# Altium project RPi-CM-Lite.PrjPcb (part 5 of 5)

## Sheet HDMI2CVBS.SchDoc
size A4; SheetNumber: 7; SheetTotal: 7
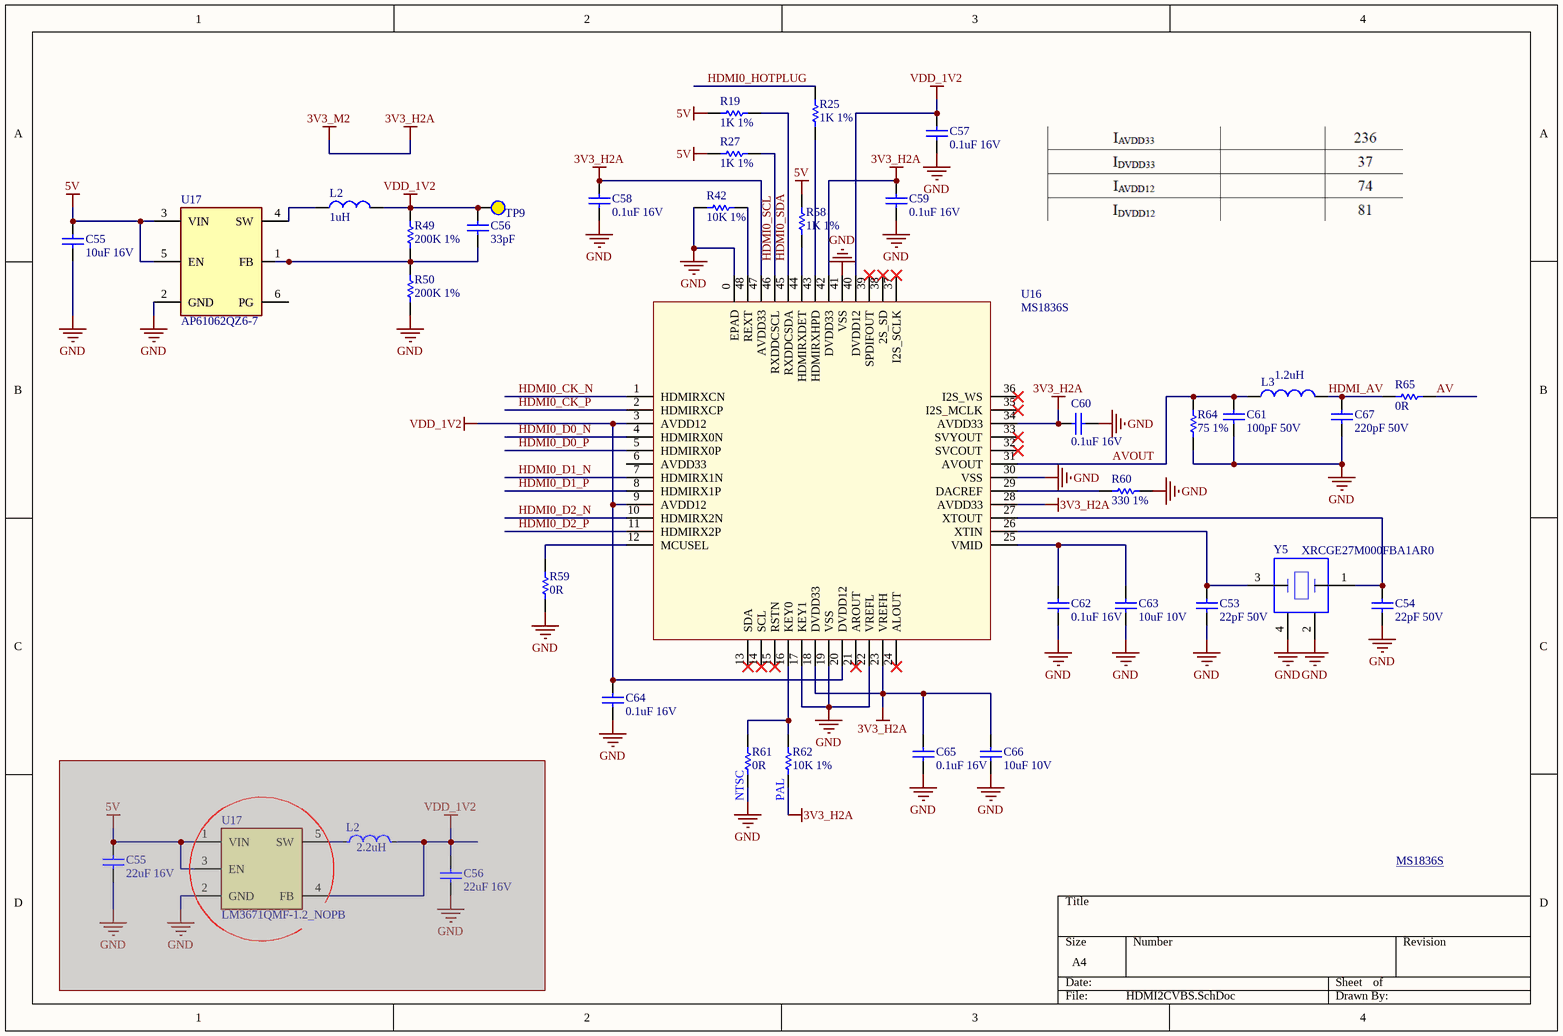
[diagram p6: HDMI2CVBS.SchDoc]

### Parts
(Parts that share a designator on the sheet are numbered #1, #2 ... from top to bottom, then left to right.)
C53  22pF 50V  [0402]
C54  22pF 50V  [0402]
C55#1  10uF 16V  [C0805]
C55#2  22uF 16V  [C0805]  (masked out: inside a compile mask, not in the netlist)
C56#1  33pF  [0402]
C56#2  22uF 16V  [C0805]  (masked out: inside a compile mask, not in the netlist)
C57  0.1uF 16V  [0402]
C58  0.1uF 16V  [0402]
C59  0.1uF 16V  [0402]
C60  0.1uF 16V  [0402]
C61  100pF 50V  [0402]
C62  0.1uF 16V  [0402]
C63  10uF 10V  [1608[0603]]
C64  0.1uF 16V  [0402]
C65  0.1uF 16V  [0402]
C66  10uF 10V  [1608[0603]]
C67  220pF 50V  [0402]
L2#1  1uH  [INDC2012X145N]
L2#2  Inductance: 2.2uH  [FP-MLZ2012-1_25-IPC_A]  (hidden comment: MLZ2012M2R2HT000)  (masked out: inside a compile mask, not in the netlist)
L3  1.2uH  [0402_CAP]
R19  1K 1%  [0402]
R25  1K 1%  [0402]
R27  1K 1%  [0402]
R42  10K 1%  [0402]
R49#2  200K 1%  [0402]
R50  200K 1%  [0402]
R58  1K 1%  [0402]
R59  0R  [0402]
R60  330 1%  [0402]
R61  0R  [0402]
R62  10K 1%  [0402]
R64  75 1%  [0402]
R65  0R  [0402]
TP9  TESTPOINT  [TESTPOINT_0.9]  (value not drawn)  (no BOM)
U16  MS1836S  [PQFN50P700X700X100_HS-49M]
U17#1  AP61062QZ6-7  [AP61062Q]
U17#2  LM3671QMF-1.2_NOPB  [SOT95P280X145-5N]  (masked out: inside a compile mask, not in the netlist)
Y5  XRCGE27M000FBA1AR0  [XRCGE20M000F3A1AR0]

### Nets
3V3_H2A: C58.2 C59.2 C60.2 C65.1 C66.2 R62.2 U16.18(DVDD33) U16.23(VREFH) U16.28(AVDD33) U16.34(AVDD33) U16.42(DVDD33) U16.47(AVDD33)  [also labelled 3V3_M2]
5V: C55#1.2 R19.2 R27.2 R58.2 U17#1.3(VIN) U17#1.5(EN)
GND: C53.1 C54.1 C55#1.1 C57.1 C58.1 C59.1 C60.1 C61.1 C62.2 C63.1 C64.2 C65.2 C66.1 C67.1 R42.2 R50.1 R59.2 R60.2 R61.2 R64.1 U16.0(EPAD) U16.17(KEY1) U16.19(VSS) U16.22(VREFL) U16.30(VSS) U16.41(VSS) U17#1.2(GND) Y5.2 Y5.4
VDD_1V2: C56#1.2 C57.2 C64.1 L2#1.2 R49#2.2 TP9.1 U16.3(AVDD12) U16.9(AVDD12) U16.20(DVDD12) U16.40(DVDD12)
AV: R65.2
AVOUT: C61.2 L3.1 R64.2 U16.31(AVOUT)
HDMI0_CK_N: U16.1(HDMIRXCN)
HDMI0_CK_P: U16.2(HDMIRXCP)
HDMI0_D0_N: U16.4(HDMIRX0N)
HDMI0_D0_P: U16.5(HDMIRX0P)
HDMI0_D1_N: U16.7(HDMIRX1N)
HDMI0_D1_P: U16.8(HDMIRX1P)
HDMI0_D2_N: U16.10(HDMIRX2N)
HDMI0_D2_P: U16.11(HDMIRX2P)
HDMI0_HOTPLUG: R25.2
HDMI0_SCL: R27.1 U16.46(RXDDCSCL)
HDMI0_SDA: R19.1 U16.45(RXDDCSDA)
HDMI_AV: C67.2 L3.2 R65.1
NetC53_2: C53.2 U16.26(XTIN) Y5.3
NetC54_2: C54.2 U16.27(XTOUT) Y5.1
NetC56#1_1: C56#1.1 R49#2.1 R50.2 U17#1.1(FB)
NetC62_1: C62.1 C63.2 U16.25(VMID)
NetL2#1_1: L2#1.1 U17#1.4(SW)
NetR25_1: R25.1 U16.43(HDMIRXHPD)
NetR42_1: R42.1 U16.48(REXT)
NetR58_1: R58.1 U16.44(HDMIRXDET)
NetR59_1: R59.1 U16.12(MCUSEL)
NetR60_1: R60.1 U16.29(DACREF)
NetR61_1: R61.1 R62.1 U16.16(KEY0)

Not connected (* = marked no-connect by the designer): U16 6(AVDD33) 13(SDA)* 14(SCL)* 15(RSTN)* 21(AROUT)* 24(ALOUT)* 32(SVCOUT)* 33(SVYOUT)* 35(I2S_MCLK)* 36(I2S_WS)* 37(I2S_SCLK)* 38(2S_SD)* 39(SPDIFOUT)*; U17#1 6(PG)

### Notes on the sheet
- (near R61) NTSC
- (near R62) PAL
- MS1836S <http://en.macrosilicon.com/info.asp?base_id=2&third_id=47>

### Library data of the parts
C53 C54 = Cap22PF_50V: Ceramic Capacitor (Surface Mount); Manufacturer: TDK Corporation; Manufacturer Part Number: C1005C0G1H220J050BA; Tolerance: ±5%; Temperature Coefficient: C0G, NP0; Supplier 1: Digi-Key; RoHS: RoHS Compliant; Category: Capacitors; Stock 1: 109785; Pricing 1: 1=0.1, 10=0.024, 100=0.011, 250=0.009, 500=0.0077, 1000=0.006, 5000=0.005 (USD); Packaging: Cut Tape (CT); Capacitance: 22pF; Voltage - Rated: 50V; Mounting Type: Surface Mount, MLCC; Operating Temperature: -55°C ~ 125°C; Applications: General Purpose; Ratings: -; Package / Case: 0402 (1005 Metric); Size / Dimension: 0.039" L x 0.020" W (1.00mm x 0.50mm); Height - Seated (Max): -; Thickness (Max): 0.022" (0.55mm); Lead Spacing: -; Features: -; Lead Style: -; ComponentLink1URL: https://product.tdk.com/info/en/catalog/datasheets/mlcc_commercial_general_en.pdf; ComponentLink1Description: https://product.tdk.com/info/en/catalog/datasheets/mlcc_commercial_general_en.pdf; Supplier Part Number 1: 445-1239-1-ND
C55#1 = Cap10UF_16V_0805_X7R: 16V 10uF X7R ±10% 0805 Multilayer Ceramic Capacitors MLCC - SMD/SMT ROHS; Manufacturer: Samsung Electro-Mechanics; Manufacturer Part Number: CL21B106KOQNNNE; Value: 10µF; Supplier 1: Mouser; Supplier Part Number 1: 187-CL21B106KOQNNNE; Supplier: Mouser; Supplier Part Number: 187-CL21B106KOQNNNE; RoHS: Compliant; Category: Ceramic Capacitors; Stock: 602217; Pricing: 1=0.22, 1=0.189, 10=0.133, 10=0.114, 50=0.133, 100=0.069, 100=0.08, 500=0.055, 1000=0.054, 1000=0.046, 2000=0.046, 4000=0.04, 10000=0.044, 10000=0.038, 24000=0.037 (USD); ComponentLink1URL: https://datasheet.octopart.com:443/CL21B106KOQNNNE-Samsung-Electro-Mechanics-datasheet-136482503.pdf?src-supplier=IHS; ComponentLink1Description: https://datasheet.octopart.com:443/CL21B106KOQNNNE-Samsung-Electro-Mechanics-datasheet-136482503.pdf?src-supplier=IHS; Case/Package: 0805; Case Code (Imperial): 0805; Case Code (Metric): 2012; China RoHS: Compliant; Contact Plating: Tin; Depth: 1.25mm; Dielectric: X7R; Dielectric Material: Ceramic; Height: 1.4mm; Length: 2mm; Lifecycle Status: Production; Material: Ceramic; Max Operating Temperature: 125°C; Min Operating Temperature: -55°C; Mounting Technology: Surface Mount; Number of Terminals: 2; Radiation Hardening: No; REACH SVHC: Yes; Schedule B: 8532240020, 8532240020|8532240020, 8532240020|8532240020|8532240020, 8532240020|8532240020|8532240020|8532240020; Thickness: 1.397mm; Tolerance: 10%; Voltage: 16V; Voltage Rating: 16V; Voltage Rating (DC): 16V; Width: 1.25mm; ComponentLink2URL: https://datasheet.octopart.com:443/CL21B106KOQNNNE-Samsung-Electro-Mechanics-datasheet-116891046.pdf?src-supplier=Future+Electronics; ComponentLink2Description: https://datasheet.octopart.com:443/CL21B106KOQNNNE-Samsung-Electro-Mechanics-datasheet-116891046.pdf?src-supplier=Future+Electronics; ComponentLink3URL: https://datasheet.octopart.com:443/CL21B106KOQNNNE-Samsung-Electro-Mechanics-datasheet-81462191.pdf?src-supplier=Future+Electronics; ComponentLink3Description: https://datasheet.octopart.com:443/CL21B106KOQNNNE-Samsung-Electro-Mechanics-datasheet-81462191.pdf?src-supplier=Future+Electronics; ComponentLink4URL: https://datasheet.octopart.com:443/CL21B106KOQNNNE-Samsung-datasheet-12530662.pdf?src-supplier=Future+Electronics; ComponentLink4Description: https://datasheet.octopart.com:443/CL21B106KOQNNNE-Samsung-datasheet-12530662.pdf?src-supplier=Future+Electronics; ComponentLink5URL: https://datasheet.octopart.com:443/CL21B106KOQNNNE-Samsung-datasheet-26669285.pdf?src-supplier=Future+Electronics; ComponentLink5Description: https://datasheet.octopart.com:443/CL21B106KOQNNNE-Samsung-datasheet-26669285.pdf?src-supplier=Future+Electronics; ComponentLink6URL: https://datasheet.octopart.com:443/CL21B106KOQNNNE-Samsung-Electro-Mechanics-datasheet-149045986.pdf?src-supplier=Future+Electronics; ComponentLink6Description: https://datasheet.octopart.com:443/CL21B106KOQNNNE-Samsung-Electro-Mechanics-datasheet-149045986.pdf?src-supplier=Future+Electronics; ComponentLink7URL: https://datasheet.octopart.com/CL21B106KOQNNNE-Samsung-Electro-Mechanics-datasheet-97040617.pdf; ComponentLink7Description: https://datasheet.octopart.com/CL21B106KOQNNNE-Samsung-Electro-Mechanics-datasheet-97040617.pdf; ComponentLink8URL: https://datasheet.octopart.com/CL21B106KOQNNNE-Samsung-Electro-Mechanics-datasheet-8324245.pdf; ComponentLink8Description: https://datasheet.octopart.com/CL21B106KOQNNNE-Samsung-Electro-Mechanics-datasheet-8324245.pdf; ComponentLink9URL: https://datasheet.octopart.com/General-Multilayer-Ceramic-Capacitors-Samsung-datasheet-family-111.pdf; ComponentLink9Description: https://datasheet.octopart.com/General-Multilayer-Ceramic-Capacitors-Samsung-datasheet-family-111.pdf; ComponentLink10URL: https://datasheet.octopart.com:443/CL21B106KOQNNNE-Samsung-Electro-Mechanics-datasheet-11806859.pdf?src-supplier=Arrow+Electronics; ComponentLink10Description: https://datasheet.octopart.com:443/CL21B106KOQNNNE-Samsung-Electro-Mechanics-datasheet-11806859.pdf?src-supplier=Arrow+Electronics; ComponentLink11URL: https://datasheet.octopart.com:443/CL21B106KOQNNNE-Samsung-datasheet-8326407.pdf?src-supplier=TME; ComponentLink11Description: https://datasheet.octopart.com:443/CL21B106KOQNNNE-Samsung-datasheet-8326407.pdf?src-supplier=TME; ComponentLink12URL: http://sigma.octopart.com:80/rohs_certificate/General-Multilayer-Ceramic-Capacitors-Samsung-family-110.pdf?src-supplier=Compliance+Statements; ComponentLink12Description: http://sigma.octopart.com:80/rohs_certificate/General-Multilayer-Ceramic-Capacitors-Samsung-family-110.pdf?src-supplier=Compliance+Statements; ComponentLink13URL: http://sigma.octopart.com:80/rohs_statement/General-Multilayer-Ceramic-Capacitors-Samsung-family-132.pdf?src-supplier=Compliance+Statements; ComponentLink13Description: http://sigma.octopart.com:80/rohs_statement/General-Multilayer-Ceramic-Capacitors-Samsung-family-132.pdf?src-supplier=Compliance+Statements; ComponentLink14URL: http://sigma.octopart.com:80/reach_statement/General-Multilayer-Ceramic-Capacitors-Samsung-family-133.pdf?src-supplier=Compliance+Statements; ComponentLink14Description: http://sigma.octopart.com:80/reach_statement/General-Multilayer-Ceramic-Capacitors-Samsung-family-133.pdf?src-supplier=Compliance+Statements
C55#2 C56#2 = Cap22UF_16V: Ceramic Capacitor (Surface Mount); Manufacturer: Samsung Electro-Mechanics America, Inc.; Manufacturer Part Number: CL21A226MOCLRNC; Capacitance: 22µF; Tolerance: ±20%; Temperature Coefficient: X5R; Supplier 1: Digi-Key; RoHS: RoHS Compliant; Category: Capacitors; Stock 1: 185791; Pricing 1: 1=0.24, 10=0.168, 25=0.1344, 50=0.1118, 100=0.0951, 250=0.07548, 500=0.0671, 1000=0.05872 (USD); Packaging: Cut Tape (CT); Part Status: Active; Voltage - Rated: 16V; Operating Temperature: -55°C ~ 85°C; Features: Low Profile; Ratings: -; Applications: General Purpose; Mounting Type: Surface Mount, MLCC; Package / Case: 0805 (2012 Metric); Size / Dimension: 0.079" L x 0.049" W (2.00mm x 1.25mm); Height - Seated (Max): -; Thickness (Max): 0.037" (0.95mm); Lead Spacing: -; Lead Style: -; ComponentLink1URL: http://www.samsungsem.com/kr/support/library/product-catalog/__icsFiles/afieldfile/2016/09/27/MLCC.pdf; ComponentLink1Description: http://www.samsungsem.com/kr/support/library/product-catalog/__icsFiles/afieldfile/2016/09/27/MLCC.pdf; Supplier Part Number 1: 1276-6780-1-ND; Supplier 2: Mouser; Supplier Part Number 2: 81-GRM219R61C226ME1K
C56#1 = Cap33PF: Ceramic Capacitor (Surface Mount); Tolerance: ±1%; Supplier 1: Mouser; Supplier Part Number 1: 81-GJM1555C1H330FB1D
C57-C60 C62 C64 C65 = Cap0.1UF_16V_X7R: 0402 0.1 uF 16V ±10% Tolerance X7R SMT Multilayer Ceramic Capacitor; Manufacturer: Murata; Manufacturer Part Number: GCM155R71C104KA55J; Value: 100nF; RoHS: Yes; Category: Ceramic Capacitors; Stock 1: 2121057; Pricing 1: 1=0,10000, 10=0,01800, 50=0,01800, 100=0,01500, 1000=0,00900, 10000=0,00700 (USD); Mounting Technology: Surface Mount; Case/Package: 0402; Case Code (Imperial): 0402; Case Code (Metric): 1005; Min Operating Temperature: -55°C; Max Operating Temperature: 125°C; Tolerance: 10%; Voltage Rating: 16V; Voltage Rating (DC): 16V; Packaging: Tape and Reel; Package Quantity: 1; Dielectric: X7R; Termination: SMD/SMT; Series: GCM; Construction: Flat; Length: 1mm; Width: 0.5mm; Height: 0.5mm; Thickness: 0.022inch; Depth: 0.5mm; Ratings: AEC-Q200; Radiation Hardening: No; Lead Free: Lead Free; RoHS Compliant: Yes; ComponentLink1URL: https://datasheet.ciiva.com/11618/product-11618848.pdf?src-supplier=Avnet; ComponentLink1Description: https://datasheet.ciiva.com/11618/product-11618848.pdf?src-supplier=Avnet; ComponentLink2URL: https://datasheet.ciiva.com/16440/gcm155r71c104ka55j-16440393.pdf?src-supplier=Future+Electronics; ComponentLink2Description: https://datasheet.ciiva.com/16440/gcm155r71c104ka55j-16440393.pdf?src-supplier=Future+Electronics; ComponentLink3URL: https://datasheet.ciiva.com/29542/product-29542474.pdf?src-supplier=Digi-Key; ComponentLink3Description: https://datasheet.ciiva.com/29542/product-29542474.pdf?src-supplier=Digi-Key; ComponentLink4URL: https://datasheet.ciiva.com/29542/product-29542475.pdf?src-supplier=Digi-Key; ComponentLink4Description: https://datasheet.ciiva.com/29542/product-29542475.pdf?src-supplier=Digi-Key; Supplier 1: Mouser; Supplier 2: Digi-Key; Supplier Part Number 1: 81-GCM155R71C104KA5J; Supplier Part Number 2: 490-7998-1-ND
C61 = Cap100PF_50V: Ceramic Capacitor (Surface Mount); Manufacturer: Yageo; Manufacturer Part Number: CC0402JRNPO9BN101; Tolerance: ±5%; Temperature Coefficient: C0G, NP0; Supplier 1: Digi-Key; RoHS: RoHS Compliant; Category: Capacitors; Stock 1: 1690327; Pricing 1: 1=0.1, 10=0.013, 25=0.0092, 100=0.006, 250=0.00492, 500=0.0042, 1000=0.00328, 2500=0.00295, 5000=0.00273 (USD); Packaging: Cut Tape (CT); Part Status: Active; Capacitance: 100pF; Voltage - Rated: 50V; Operating Temperature: -55°C ~ 125°C; Features: -; Ratings: -; Applications: General Purpose; Failure Rate: -; Mounting Type: Surface Mount, MLCC; Package / Case: 0402 (1005 Metric); Size / Dimension: 0.039" L x 0.020" W (1.00mm x 0.50mm); Height - Seated (Max): -; Thickness (Max): 0.022" (0.55mm); Lead Spacing: -; Lead Style: -; ComponentLink1URL: http://www.yageo.com/NewPortal/yageodocoutput?fileName=/pdf/MLCC/UPY-GP_NP0_16V-to-50V_14.pdf; ComponentLink1Description: http://www.yageo.com/NewPortal/yageodocoutput?fileName=/pdf/MLCC/UPY-GP_NP0_16V-to-50V_14.pdf; Supplier Part Number 1: 311-1024-1-ND
C63 C66 = Cap10UF_10V_0603: Ceramic Capacitor (Surface Mount) Low ESL; Manufacturer: TDK; Manufacturer Part Number: C1608X5R1A106M080AC; Tolerance: 20%; Dielectric: X5R; Supplier 1: Digi-Key; Stock 1: 549066; Pricing 1: 1=0.43, 10=0.298, 100=0.1785, 500=0.1339, 1000=0.1131 (USD); Mount: Surface Mount; Case/Package: 0603; Number of Pins: 2; Weight: 7.1E-05oz; Case Code (Metric): 1608; Case Code (Imperial): 0603; Dielectric Material: Ceramic; Min Operating Temperature: -55°C; Max Operating Temperature: 85°C; Capacitance: 10uF; Voltage Rating: 10V; Packaging: Tape and Reel; Package Quantity: 1; Voltage Rating (DC): 10V; Termination: SMD/SMT; Composition: Ceramic; Length: 1.6mm; Height: 0.8mm; Width: 0.031inch; Thickness: 0.035inch; Depth: 0.8mm; Radiation Hardening: No; REACH SVHC: No SVHC; Lead Free: Lead Free; ComponentLink1URL: https://datasheet.ciiva.com/15192/getdatasheetpartid-722046-15192006.pdf; ComponentLink1Description: https://datasheet.ciiva.com/15192/getdatasheetpartid-722046-15192006.pdf; ComponentLink2URL: https://datasheet.ciiva.com/17487/e412-c-17487513.pdf; ComponentLink2Description: https://datasheet.ciiva.com/17487/e412-c-17487513.pdf; ComponentLink3URL: https://datasheet.ciiva.com/24312/2958c1608x5r1a106m080ac-24312391.pdf; ComponentLink3Description: https://datasheet.ciiva.com/24312/2958c1608x5r1a106m080ac-24312391.pdf; ComponentLink4URL: https://datasheet.ciiva.com/16508/e412-c-16508686.pdf; ComponentLink4Description: https://datasheet.ciiva.com/16508/e412-c-16508686.pdf; ComponentLink5URL: https://datasheet.ciiva.com/22749/1744655-22749594.pdf; ComponentLink5Description: https://datasheet.ciiva.com/22749/1744655-22749594.pdf; ComponentLink6URL: https://datasheet.ciiva.com/36857/1796654-36857302.pdf; ComponentLink6Description: https://datasheet.ciiva.com/36857/1796654-36857302.pdf; ComponentLink7URL: https://datasheet.ciiva.com/6288/tdkmlcccaprange-6288534.pdf; ComponentLink7Description: https://datasheet.ciiva.com/6288/tdkmlcccaprange-6288534.pdf; ComponentLink8URL: https://datasheet.ciiva.com/22676/639999-22676919.pdf; ComponentLink8Description: https://datasheet.ciiva.com/22676/639999-22676919.pdf; ComponentLink9URL: https://datasheet.ciiva.com/48671/e412-c-48671302.pdf; ComponentLink9Description: https://datasheet.ciiva.com/48671/e412-c-48671302.pdf; Supplier Part Number 1: 445-6853-1-ND
C67 = Cap220PF_50V: Multilayer Ceramic Capacitor, 220 pF, 50 V, ± 5%, C0G (NP0), 0402 [1005 Metric]; Manufacturer: Samsung; Manufacturer Part Number: CL05C221JB51PNC; Material: 4241ConductorMaterial; Temperature Coefficient: 30ppm/°C; Supplier: Mouser; Supplier Part Number: 187-CL05C221JB51PNC; RoHS: Yes; Category: Ceramic Capacitors; Stock: 196350; Pricing: 1=0.1, 10=0.021, 50=0.021, 100=0.015, 1000=0.012, 10000=0.008 (USD); Height: 550um; ComponentLink1URL: http://www.samsungsem.com/kr/support/product-search/mlcc/CL05C221JB51PNC.jsp?src-supplier=Digikey; ComponentLink1Description: http://www.samsungsem.com/kr/support/product-search/mlcc/CL05C221JB51PNC.jsp?src-supplier=Digikey; ComponentLink2URL: http://www.samsungsem.com/kr/support/library/product-catalog/mlcc.jsp?src-supplier=Digikey; ComponentLink2Description: http://www.samsungsem.com/kr/support/library/product-catalog/mlcc.jsp?src-supplier=Digikey; ComponentLink3URL: https://datasheet.octopart.com/CL05C221JB51PNC-Samsung-Electro-Mechanics-datasheet-149154090.pdf?src-supplier=Future+Electronics; ComponentLink3Description: https://datasheet.octopart.com/CL05C221JB51PNC-Samsung-Electro-Mechanics-datasheet-149154090.pdf?src-supplier=Future+Electronics; ComponentLink4URL: https://datasheet.octopart.com/CL05C221JB51PNC-Samsung-datasheet-8326407.pdf?src-supplier=TME; ComponentLink4Description: https://datasheet.octopart.com/CL05C221JB51PNC-Samsung-datasheet-8326407.pdf?src-supplier=TME; Supplier 1: Mouser; Supplier Part Number 1: 187-CL05C221JB51PNC
L2#1 = INDUCTOR_1uH_800mA_MLZ2012M1R0HT000: Inductor Power Shielded Multi-Layer 1uH 20% 2MHz Ferrite 0.8A 0.13Ohm DCR 0805 T/R; Manufacturer_Name: TDK; Manufacturer Lifecycle Status: PRODUCTION; Current Rating: 800mA; DC Resistance (DCR): 130mΩ; Value: 1µH; Number of Circuits: 1; Saturation Current: 700mA; Self Resonant Frequency: 150MHz; Shielding: Yes; Datasheet Link: https://product.tdk.com/system/files/dam/doc/product/inductor/inductor/smd/catalog/inductor_commercial_decoupling_mlz2012_en.pdf; Height: 1.45mm; Manufacturer_Part_Number: MLZ2012M1R0HT000; Mouser Part Number: 810-MLZ2012M1R0HT000; Mouser Price/Stock: https://www.mouser.co.uk/ProductDetail/TDK/MLZ2012M1R0HT000?qs=%2FPzWLGNeQ%252BgvLqMrL%252Bty7w%3D%3D; Arrow Part Number: MLZ2012M1R0HT000; Arrow Price/Stock: https://www.arrow.com/en/products/mlz2012m1r0ht000/tdk?utm_currency=USD&region=nac; Supplier: Mouser; Supplier Part Number: 810-MLZ2012M1R0HT000; Manufacturer: TDK; Manufacturer Part Number: MLZ2012M1R0HT000; RoHS: Compliant; Category: Fixed Inductors; Stock: 49869; Pricing: 1=0.1, 10=0.076, 50=0.076, 100=0.063, 1000=0.047, 10000=0.038 (USD); Case/Package: 0805; Case Code (Imperial): 0805; Case Code (Metric): 2012; Core Material: Ferrite; Height - Seated (Max): 1.4478mm; Lead Free: Lead Free; Length: 2mm; Lifecycle Status: Production; Max Current Rating: 800mA; Max Length: 2.2mm; Max Operating Temperature: 125°C; Max Width: 1.45mm; Min Length: 1.8mm; Min Operating Temperature: -55°C; Min Width: 1.05mm; Mounting Technology: Surface Mount; Number of Terminals: 2; Packaging: Tape & Reel (TR); REACH SVHC: Yes; RMS Current (Irms): 800mA; Schedule B: 8504500000, 8504500000|8504500000|8504500000|8504500000|8504500000; ESR: 130mΩ; Test Frequency: 2MHz; Tolerance: 20%; Width: 1.25mm; ComponentLink1URL: https://datasheet.octopart.com:443/MLZ2012M1R0HT000-TDK-datasheet-155380168.pdf?src-supplier=TDK; ComponentLink1Description: https://datasheet.octopart.com:443/MLZ2012M1R0HT000-TDK-datasheet-155380168.pdf?src-supplier=TDK; ComponentLink2URL: https://datasheet.octopart.com:443/MLZ2012M1R0HT000-TDK-datasheet-166125048.pdf?src-supplier=ODG+(Origin+Data+Global); ComponentLink2Description: https://datasheet.octopart.com:443/MLZ2012M1R0HT000-TDK-datasheet-166125048.pdf?src-supplier=ODG+(Origin+Data+Global); ComponentLink3URL: https://datasheet.octopart.com:443/MLZ2012M1R0HT000-TDK-datasheet-46749535.pdf?src-supplier=Future+Electronics; ComponentLink3Description: https://datasheet.octopart.com:443/MLZ2012M1R0HT000-TDK-datasheet-46749535.pdf?src-supplier=Future+Electronics; ComponentLink4URL: https://datasheet.octopart.com:443/MLZ2012M1R0HT000-TDK-datasheet-37128881.pdf?src-supplier=Future+Electronics; ComponentLink4Description: https://datasheet.octopart.com:443/MLZ2012M1R0HT000-TDK-datasheet-37128881.pdf?src-supplier=Future+Electronics; ComponentLink5URL: https://datasheet.octopart.com:443/MLZ2012M1R0HT000-TDK-datasheet-136874819.pdf?src-supplier=TME; ComponentLink5Description: https://datasheet.octopart.com:443/MLZ2012M1R0HT000-TDK-datasheet-136874819.pdf?src-supplier=TME; ComponentLink6URL: https://datasheet.octopart.com:443/MLZ2012M1R0HT000-TDK-datasheet-17023265.pdf?src-supplier=Electro+Sonic; ComponentLink6Description: https://datasheet.octopart.com:443/MLZ2012M1R0HT000-TDK-datasheet-17023265.pdf?src-supplier=Electro+Sonic; Supplier 1: Mouser; Supplier Part Number 1: 810-MLZ2012M1R0HT000
L2#2 = CMP-08253-000093-1: Shielded Multilayer Inductor 2.2uH ±20% 600mA 208mΩ SMD 0805; Core Material: Ferrite; Self Resonant Frequency: 100MHz; DC Resistance (DCR): 208mR; Test Frequency: 2MHz; Saturation Current: 400mA; Length: 0.079inch; Mount: Surface Mount; Current Rating: 600mA; Height - Seated (Max): 0.041inch; Lead Free: Lead Free; Min Operating Temperature: -55°C; Width: 0.049inch; Tolerance: 20%; Case Code (Metric): 2012; Case/Package: 0805; Package Quantity: 2000; Packaging: Tape and Reel; RoHS Compliant: Yes; Shielding: Shielded; Max Operating Temperature: 125°C; Case Code (Imperial): 0805
L3 = Inductor_1.2uH_0402: Inductor for Standard Circuits Multilayer Ferrite 1.2uH 2-Pin SMD T/R; Manufacturer: TDK; Manufacturer Part Number: MLF1005G1R2JTD25; Tolerance: 5%; Shielding: Shielded; DC Resistance (DCR): 790mR; Self Resonant Frequency: 110MHz; Test Frequency: 10MHz; Supplier: Mouser; Supplier Part Number: 810-MLF1005G1R2JTD25; RoHS: Yes; Category: Fixed Inductors; Stock: 7179; Pricing: 1=0.18, 10=0.096, 50=0.096, 100=0.094, 1000=0.083, 10000=0.082 (USD); Mounting Technology: Surface Mount; Case/Package: 0402; Core Material: Ferrite; Case Code (Imperial): 0402; Case Code (Metric): 1005; Min Operating Temperature: -55°C; Max Operating Temperature: 125°C; Series: MLF; Packaging: Cut Tape; Value: 1.2uH; Ratings: AEC-Q200; RoHS Compliant: Yes; ComponentLink1URL: https://product.tdk.com/info/en/catalog/datasheets/inductor_automotive_standard_mlf1005_en.pdf?src-supplier=Digikey; ComponentLink1Description: https://product.tdk.com/info/en/catalog/datasheets/inductor_automotive_standard_mlf1005_en.pdf?src-supplier=Digikey; Supplier 1: Mouser; Supplier Part Number 1: 810-MLF1005G1R2JTD25
R19 R25 R27 R58 = Res_1K_0402: Resistor 1K 1% 0402; Manufacturer: Yageo; Manufacturer Part Number: RC0402FR-071KL; Power (Watts): 0.063W, 1/16W; Temperature Coefficient: ±100ppm/°C; Supplier 1: Digi-Key; RoHS: RoHS Compliant; Category: Resistors; Stock 1: 2519228; Pricing 1: 1=0.1, 10=0.013, 25=0.0096, 100=0.0054, 250=0.00412, 500=0.00328, 1000=0.00242, 2500=0.0021, 5000=0.00173 (USD); Packaging: Cut Tape (CT); Resistance (Ohms): 1k; Tolerance: ±1%; Composition: Thick Film; Features: Moisture Resistant; Operating Temperature: -55°C ~ 155°C; Package / Case: 0402 (1005 Metric); Supplier Device Package: 0402; Size / Dimension: 0.039" L x 0.020" W (1.00mm x 0.50mm); Height: 0.016" (0.40mm); Number of Terminations: 2; ComponentLink1URL: http://www.yageo.com/NewPortal/yageodocoutput?fileName=/pdf/R-Chip/PYu-RC_Group_51_RoHS_L_3.pdf; ComponentLink1Description: http://www.yageo.com/NewPortal/yageodocoutput?fileName=/pdf/R-Chip/PYu-RC_Group_51_RoHS_L_3.pdf; Supplier Part Number 1: 311-1.00KLRCT-ND; MountType: SMT
R42 R62 = Res_10K_0402: Resistor; Manufacturer: Yageo; Manufacturer Part Number: RC0402FR-0710KL; Power (Watts): 0.063W, 1/16W; Temperature Coefficient: ±100ppm/°C; Supplier 1: Digi-Key; RoHS: RoHS Compliant; Category: Resistors; Stock 1: 2634839; Pricing 1: 1=0.1, 10=0.013, 25=0.0096, 100=0.0054, 250=0.00412, 500=0.00328, 1000=0.00242, 2500=0.0021, 5000=0.00173 (USD); Packaging: Cut Tape (CT); Resistance (Ohms): 10k; Tolerance: ±1%; Composition: Thick Film; Features: Moisture Resistant; Operating Temperature: -55°C ~ 155°C; Package / Case: 0402 (1005 Metric); Supplier Device Package: 0402; Size / Dimension: 0.039" L x 0.020" W (1.00mm x 0.50mm); Height: 0.016" (0.40mm); Number of Terminations: 2; ComponentLink1URL: http://www.yageo.com/NewPortal/yageodocoutput?fileName=/pdf/R-Chip/PYu-RC_Group_51_RoHS_L_3.pdf; ComponentLink1Description: http://www.yageo.com/NewPortal/yageodocoutput?fileName=/pdf/R-Chip/PYu-RC_Group_51_RoHS_L_3.pdf; Supplier Part Number 1: 311-10.0KLRCT-ND; MountType: SMT
R49#2 R50 = Res_200K_0402: Resistor; Manufacturer: Panasonic Electronic Components; Manufacturer Part Number: ERJ-2RKF2003X; Power (Watts): 0.1W, 1/10W; Temperature Coefficient: ±100ppm/°C; Supplier 1: Digi-Key; RoHS: RoHS Compliant; Category: Resistors; Stock 1: 675191; Pricing 1: 1=0.1, 10=0.025, 25=0.018, 50=0.0136, 100=0.01, 250=0.00764, 500=0.00612, 1000=0.00451, 5000=0.00323 (USD); Packaging: Cut Tape (CT); Part Status: Active; Resistance (Ohms): 200k; Tolerance: ±1%; Composition: Thick Film; Features: Automotive AEC-Q200; Operating Temperature: -55°C ~ 155°C; Package / Case: 0402 (1005 Metric); Supplier Device Package: 0402; Size / Dimension: 0.039" L x 0.020" W (1.00mm x 0.50mm); Height - Seated (Max): 0.016" (0.40mm); Failure Rate: -; ComponentLink1URL: https://industrial.panasonic.com/cdbs/www-data/pdf/RDA0000/AOA0000C283.pdf; ComponentLink1Description: https://industrial.panasonic.com/cdbs/www-data/pdf/RDA0000/AOA0000C283.pdf; Supplier Part Number 1: P200KLCT-ND; MountType: SMT
R59 R61 R65 = Res_0R_0402: Zero ohm Jumper 0402; Manufacturer: Yageo; Manufacturer Part Number: RC0402JR-070RL; Resistance (Ohms): 0.0; Power (Watts): 0.063W, 1/16W; Category: Resistors; Tolerance: Jumper; Supplier 1: Digi-Key; RoHS: RoHS Compliant; Stock 1: 12447313; Pricing 1: 1=0.1, 10=0.013, 25=0.0092, 100=0.0053, 250=0.004, 500=0.0032, 1000=0.00236, 2500=0.00205, 5000=0.00169 (USD); Temperature Coefficient: -; Packaging: Cut Tape (CT); Number of Terminations: 2; Features: Moisture Resistant; Height: 0.016" (0.40mm); Supplier Part Number 1: 311-0.0JRCT-ND; ComponentLink1URL: http://www.yageo.com/documents/recent/PYu-RC_Group_51_RoHS_L_2.pdf; ComponentLink1Description: http://www.yageo.com/documents/recent/PYu-RC_Group_51_RoHS_L_2.pdf; Value: 0R; Composition: Thick Film; Operating Temperature: -55°C ~ 155°C; Package / Case: 0402 (1005 Metric); Supplier Device Package: 0402; Size / Dimension: 0.039" L x 0.020" W (1.00mm x 0.50mm); MountType: SMT
R60 = Res_330R_0402: Resistor; Manufacturer: Yageo; Manufacturer Part Number: RC0402FR-07330RL; Resistance (Ohms): 330; Power (Watts): 0.063W, 1/16W; Temperature Coefficient: ±100ppm/°C; Supplier 1: Digi-Key; RoHS: RoHS Compliant; Category: Resistors; Stock 1: 670469; Pricing 1: 1=0.1, 10=0.013, 25=0.0096, 100=0.0054, 250=0.00412, 500=0.00328, 1000=0.00242, 2500=0.0021, 5000=0.00173 (USD); Packaging: Cut Tape (CT); Tolerance: ±1%; Composition: Thick Film; Features: Moisture Resistant; Operating Temperature: -55°C ~ 155°C; Package / Case: 0402 (1005 Metric); Supplier Device Package: 0402; Size / Dimension: 0.039" L x 0.020" W (1.00mm x 0.50mm); Height: 0.016" (0.40mm); Number of Terminations: 2; ComponentLink1URL: http://www.yageo.com/NewPortal/yageodocoutput?fileName=/pdf/R-Chip/PYu-RC_Group_51_RoHS_L_3.pdf; ComponentLink1Description: http://www.yageo.com/NewPortal/yageodocoutput?fileName=/pdf/R-Chip/PYu-RC_Group_51_RoHS_L_3.pdf; Supplier Part Number 1: 311-330LRCT-ND; MountType: SMT
R64 = Res_75R_0402: Chip Resistor with Ni/Au Terminations Thick Film 0402 75Ohm 1% Paper T/R; Manufacturer: Yageo; Manufacturer Part Number: AR0402FR-0775RL; Value: 75R; Max Power Dissipation: 63mW; Temperature Coefficient: 100ppm/°C; MountType: SMT; Supplier: Mouser; Supplier Part Number: 603-AR0402FR-0775RL; RoHS: Yes; Category: Chip SMD Resistors; Stock: 9990; Pricing: 1=0.37, 10=0.198, 50=0.198, 100=0.117, 1000=0.076, 10000=0.054 (USD); Case/Package: 0402; Min Operating Temperature: -55°C; Max Operating Temperature: 155°C; Packaging: Tape and Reel; Number of Terminations: 2; Tolerance: 1%; Features: Moisture Resistant; Series: AR; Length: 0.039inch; Width: 0.02inch; Height: 0.016inch; RoHS Compliant: Yes; ComponentLink1URL: http://www.yageo.com/documents/recent/PYu-AR_51_RoHS_L_(7).pdf?src-supplier=Digikey; ComponentLink1Description: http://www.yageo.com/documents/recent/PYu-AR_51_RoHS_L_(7).pdf?src-supplier=Digikey; Supplier 1: Mouser; Supplier Part Number 1: 603-AR0402FR-0775RL
U16 = MS1836S: HDMI to CVBS/S-Video converter; Manufacturer: MacroSilicon; Manufacturer Part Number: MS1836S
U17#1 = AP61062QZ6-7: Switching Regulator, 0.6A, 2200kHz Switching Freq-Max, PDSO6; Manufacturer: Diodes Inc.; Max Supply Voltage: 5.5V; Max Output current: 600mA; Max Output Voltage: 3.6V; Max Switching Frequency: 2.2MHz; Min Input Voltage: 2.3V; Min Output Voltage: 600mV; Nominal Supply Voltage: 5V; Nominal Output Voltage: 1.8V; Number of Circuits: 1; Topology: Buck; Supplier: Mouser; Supplier Part Number: 621-AP61062QZ6-7; Manufacturer Part Number: AP61062QZ6-7; RoHS: Compliant; Category: Voltage Regulators - Switching; Stock: 3000; Pricing: 1=0.79, 1=0.679, 10=0.476, 10=0.409, 25=0.342, 50=0.398, 100=0.3, 100=0.258, 250=0.221, 1000=0.201, 1000=0.173, 3000=0.144, 9000=0.123, 10000=0.143 (USD); Height - Seated (Max): 600µm; Length: 1.2mm; Lifecycle Status: Production; Max Operating Temperature: 125°C; Min Operating Temperature: -40°C; Number of Terminals: 6; Terminal Pitch: 500µm; Width: 1.6mm; Supplier 1: Mouser; Supplier Part Number 1: 621-AP61062QZ6-7
U17#2 = LM3671QMF-1.2_NOPB: IC REG BUCK 1.2V 0.6A SYNC SOT23; Manufacturer_Name: Texas Instruments; Manufacturer_Part_Number: LM3671QMF-1.2/NOPB; Datasheet Link: http://www.ti.com/lit/gpn/LM3671-Q1; Height: 1.45mm; Mouser Part Number: 595-LM3671QMF1.2NOPB; Mouser Price/Stock: https://www.mouser.co.uk/ProductDetail/Texas-Instruments/LM3671QMF-12-NOPB?qs=2k4gZbgf%2F9nmAzyorDqPzQ%3D%3D; Supplier: Mouser; Supplier Part Number: 595-LM3671QMF1.2NOPB; Manufacturer: Texas Instruments; Manufacturer Part Number: LM3671QMF-1.2/NOPB; RoHS: Yes; Category: Voltage Regulators - Switching; Stock: 838; Pricing: 1=1.77, 10=1.19, 50=1.19, 100=1.06, 1000=0.8, 10000=0.799 (USD); ComponentLink1URL: https://datasheet.ciiva.com/6603/lm3671-6603941.pdf?src-supplier=Digikey; ComponentLink1Description: https://datasheet.ciiva.com/6603/lm3671-6603941.pdf?src-supplier=Digikey; Supplier 1: Mouser; Supplier Part Number 1: 595-LM3671QMF1.2NOPB
Y5 = XRCGE27M000FBA1AR0: Crystal 27.0000MHZ 6PF SMD; Manufacturer_Name: Murata Electronics; Manufacturer: Murata; Datasheet Link: https://www.murata.com/products/productdata/8805984272414/SPEC-XRCGE27M000FBA1AR0.pdf; Height: 0.7mm; Manufacturer_Part_Number: XRCGE27M000FBA1AR0; Mouser Part Number: 81-XRCGE27M000FBA1AR; Mouser Price/Stock: https://www.mouser.co.uk/ProductDetail/Murata-Electronics/XRCGE27M000FBA1AR0?qs=vmHwEFxEFR8f6ZS0NVYgWg%3D%3D; Supplier: Mouser; Supplier Part Number: 81-XRCGE27M000FBA1AR; Manufacturer Part Number: XRCGE27M000FBA1AR0; RoHS: Yes; Category: Crystals; Stock: 1454; Pricing: 1=0.36, 10=0.304, 50=0.291, 100=0.269, 1000=0.247, 10000=0.235 (USD); Supplier 1: Mouser; Supplier Part Number 1: 81-XRCGE27M000FBA1AR

## Nets that join several sheets
3V3: RPi-CM-Adapter (12 pins), USB (U5.9), MIPI-CSI (J7.1 J7.2), CVBS2MIPI (12 pins)
3V3_H2A: Power (7 pins), HDMI2CVBS (12 pins)
5V: RPi-CM-Adapter (7 pins), USB (D4.1), Power (15 pins), Sensors (R36.2), CVBS2MIPI (U14.1 U15.1), HDMI2CVBS (6 pins)
DVDD_1V8: MIPI-CSI (6 pins), CVBS2MIPI (7 pins)
GND: RPi-CM-Adapter (73 pins), USB (17 pins), Power (29 pins), MIPI-CSI (10 pins), Sensors (27 pins), CVBS2MIPI (41 pins), HDMI2CVBS (29 pins)
VIN_24: RPi-CM-Adapter (J4.1 J4.2), Power (R47.1)
AV: RPi-CM-Adapter (D12.2 J4.5 R63.1), HDMI2CVBS (R65.2)
CAM0_C_N: RPi-CM-Adapter (J2.40), CVBS2MIPI (U11.12)
CAM0_C_P: RPi-CM-Adapter (J2.42), CVBS2MIPI (U11.11)
CAM0_D0_N: RPi-CM-Adapter (J2.28), CVBS2MIPI (U11.10)
CAM1_C_N: RPi-CM-Adapter (J2.27), MIPI-CSI (J7.9)
CAM1_C_P: RPi-CM-Adapter (J2.29), MIPI-CSI (J7.10)
CAM1_D0_N: RPi-CM-Adapter (J2.15), MIPI-CSI (J7.7)
CAM1_D0_P: RPi-CM-Adapter (J2.17), MIPI-CSI (J7.8)
CAM1_D1_N: RPi-CM-Adapter (J2.21), MIPI-CSI (J7.18)
CAM1_D1_P: RPi-CM-Adapter (J2.23), MIPI-CSI (J7.19)
CAM1_D2_N: RPi-CM-Adapter (J2.33), MIPI-CSI (J7.5)
CAM1_D2_P: RPi-CM-Adapter (J2.35), MIPI-CSI (J7.6)
CAM1_D3_N: RPi-CM-Adapter (J2.39), MIPI-CSI (J7.20)
CAM1_D3_P: RPi-CM-Adapter (J2.41), MIPI-CSI (J7.21)
CAM_A1_PWR: RPi-CM-Adapter (J1.58), CVBS2MIPI (U14.3)
CAM_A2_PWR: RPi-CM-Adapter (J1.56), CVBS2MIPI (U15.3)
CAM_D_PWR: RPi-CM-Adapter (J1.37), MIPI-CSI (R28.2)
CAM_EN: RPi-CM-Adapter (J1.97), MIPI-CSI (R20.1)
CSI_nRST: RPi-CM-Adapter (J1.30), MIPI-CSI (R29.1)
CVBS_INT: RPi-CM-Adapter (J1.47), CVBS2MIPI (U11.5)
CVBS_SCL: RPi-CM-Adapter (J1.35 R22.1), CVBS2MIPI (U11.31)
CVBS_SDA: RPi-CM-Adapter (J1.36 R23.1), CVBS2MIPI (U11.30)
GLOBAL_EN: RPi-CM-Adapter (J1.99 R56.2), USB (D1.1)
GPIO16: RPi-CM-Adapter (J1.29), Sensors (R39.1 U8.6)
GPIO17: RPi-CM-Adapter (J1.50), Sensors (R38.2 U9.10)
GPIO18: RPi-CM-Adapter (J1.49), Sensors (U7.12)
GPIO19: RPi-CM-Adapter (J1.26), Sensors (U7.1 U8.5 U9.9)
GPIO20: RPi-CM-Adapter (J1.27), Sensors (U7.14 U8.4 U9.11)
GPIO21: RPi-CM-Adapter (J1.25), Sensors (U7.13 U8.2 U9.1)
GPIO24: RPi-CM-Adapter (J1.45), Sensors (U9.7)
GPIO25: RPi-CM-Adapter (J1.41), Sensors (U7.4)
GPIO26: RPi-CM-Adapter (J1.24), Sensors (U9.8)
GPIO27: RPi-CM-Adapter (J1.48), Sensors (U8.7)
HDMI0_CK_N: RPi-CM-Adapter (J2.90), HDMI2CVBS (U16.1)
HDMI0_CK_P: RPi-CM-Adapter (J2.88), HDMI2CVBS (U16.2)
HDMI0_D0_N: RPi-CM-Adapter (J2.84), HDMI2CVBS (U16.4)
HDMI0_D0_P: RPi-CM-Adapter (J2.82), HDMI2CVBS (U16.5)
HDMI0_D1_N: RPi-CM-Adapter (J2.78), HDMI2CVBS (U16.7)
HDMI0_D1_P: RPi-CM-Adapter (J2.76), HDMI2CVBS (U16.8)
HDMI0_D2_N: RPi-CM-Adapter (J2.72), HDMI2CVBS (U16.10)
HDMI0_D2_P: RPi-CM-Adapter (J2.70), HDMI2CVBS (U16.11)
HDMI0_HOTPLUG: RPi-CM-Adapter (J2.53), HDMI2CVBS (R25.2)
HDMI0_SCL: RPi-CM-Adapter (J2.100), HDMI2CVBS (R27.1 U16.46)
HDMI0_SDA: RPi-CM-Adapter (J2.99), HDMI2CVBS (R19.1 U16.45)
nRESET: RPi-CM-Adapter (J1.100), CVBS2MIPI (R54.1)
nRPIBOOT: RPi-CM-Adapter (J1.93 TP3.1), USB (D21.2 J3.A8 J3.B8)
PG: RPi-CM-Adapter (R56.1), Power (R35.2 U4#2.14)
RADIO_5V: RPi-CM-Adapter (5 pins), USB (J11#1.1)
SCL0: RPi-CM-Adapter (J1.80), MIPI-CSI (Q1.6)
SDA0: RPi-CM-Adapter (J1.82), MIPI-CSI (Q1.3)
TRD0_N: RPi-CM-Adapter (J1.10), MIPI-CSI (J8#2.7)
TRD0_P: RPi-CM-Adapter (J1.12), MIPI-CSI (J8#2.8)
TRD1_N: RPi-CM-Adapter (J1.6), MIPI-CSI (J8#2.6)
TRD1_P: RPi-CM-Adapter (J1.4), MIPI-CSI (J8#2.5)
TRD2_N: RPi-CM-Adapter (J1.9), MIPI-CSI (J8#2.3)
TRD2_P: RPi-CM-Adapter (J1.11), MIPI-CSI (J8#2.4)
TRD3_N: RPi-CM-Adapter (J1.5), MIPI-CSI (J8#2.2)
TRD3_P: RPi-CM-Adapter (J1.3), MIPI-CSI (J8#2.1)
USB2_N: RPi-CM-Adapter (J2.3), USB (U5.2)
USB2_P: RPi-CM-Adapter (J2.5), USB (U5.1)
USBOTG_ID: RPi-CM-Adapter (J2.1), USB (R1.2 R2.1 U5.10)

## Assembly variants
Main: not fitted R6 R37 R54 R59 R61 R65
Lite: not fitted C33 C34 C35 C36 C37 C38 C39 C40 C41 C42 C43 C44 C45 C46 C47 C48 C49 C50 C51 C53 C54 C57 C58 C59 C60 C61 C62 C63 C64 C65 C66 C67 D6 D7 FB1 FB2 FB3 FB4 FB5 J9 J10 L3 R6 R12 R13 R19 R25 R27 R40 R41 R42 R44 R45 R46 R54 R58 R59 R60 R61 R62 R64 R65 U11 U12 U14 U15 U16 Y3 Y5